# Altium project DB25-relay-HV-control.PrjPcb
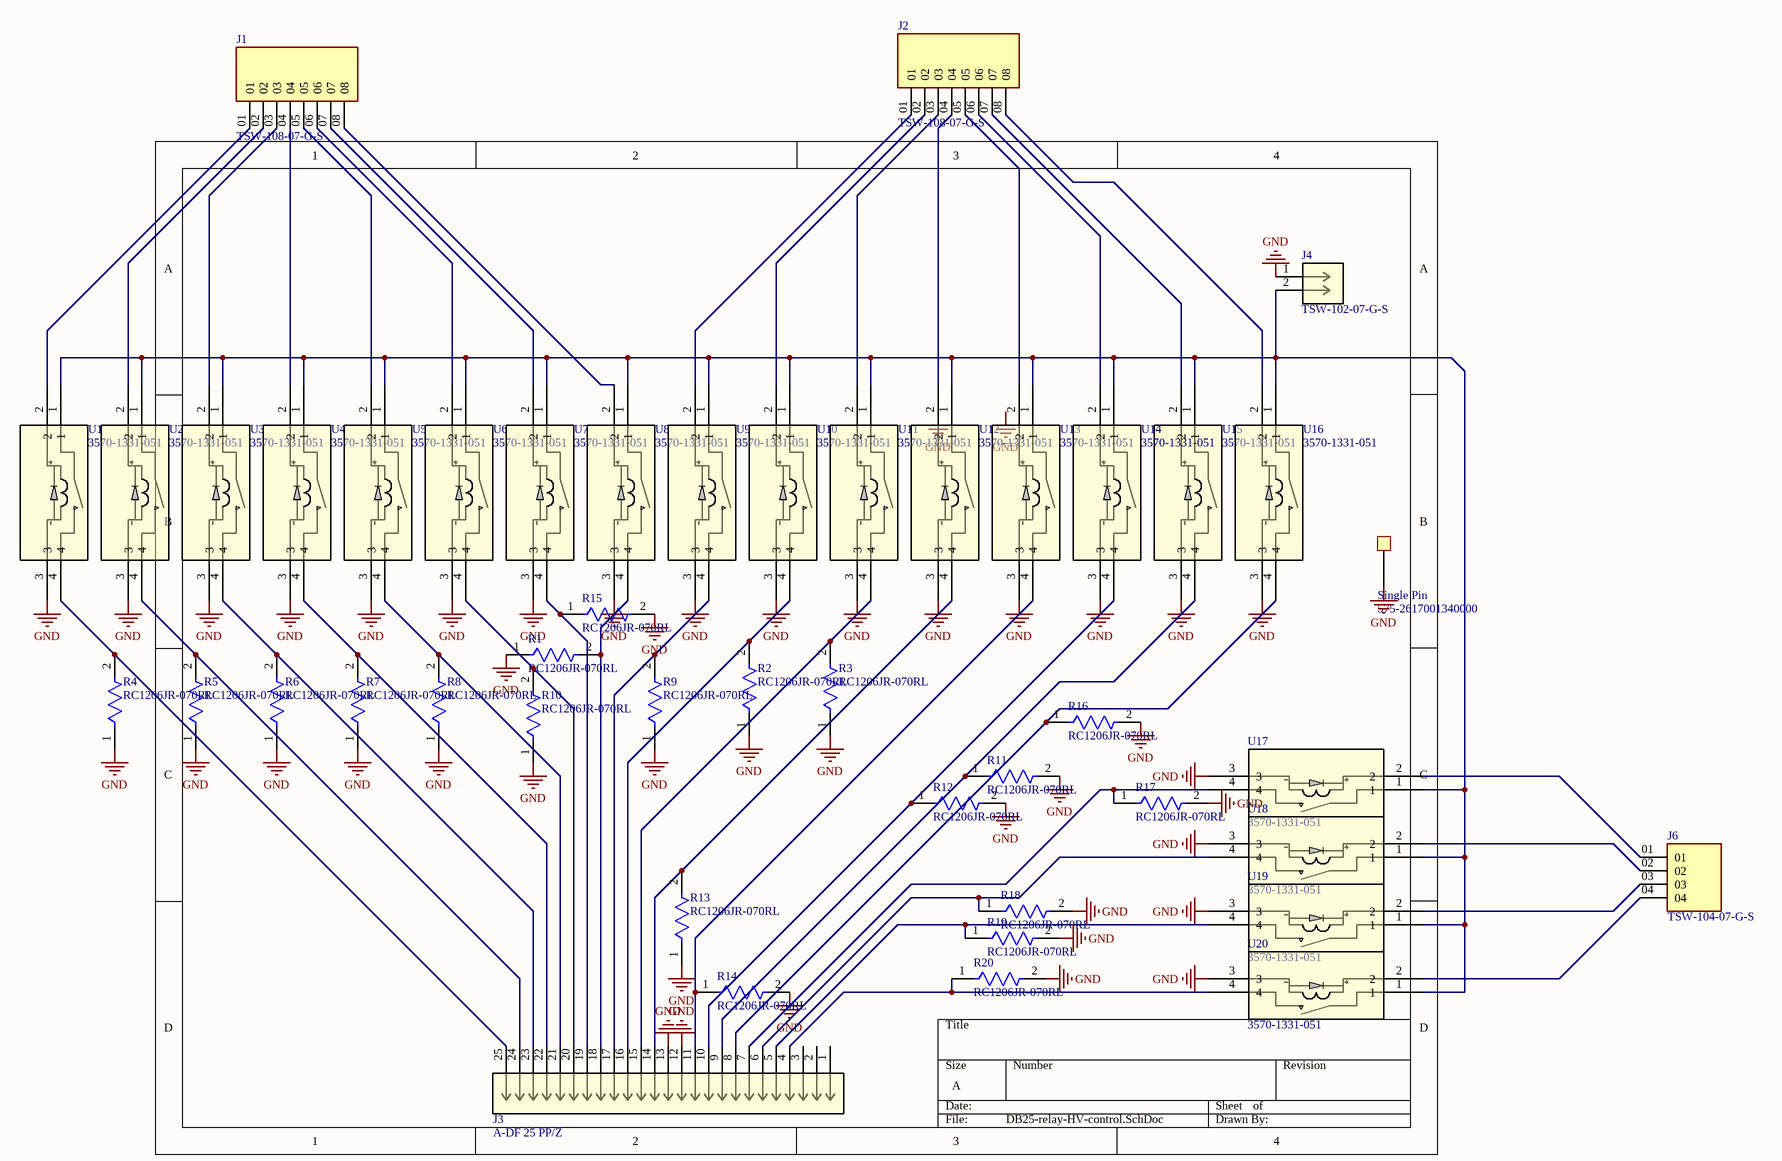
[diagram p0: DB25-relay-HV-control.SchDoc]
1 sheet, 46 parts. Net scope: global (net labels, ports and power ports of the same name join across sheets).
Board file: DB25-relay-HV-control.PcbDoc

## Sheet DB25-relay-HV-control.SchDoc
size A; SheetNumber: 1; SheetTotal: 1

### Parts
J1  TSW-108-07-G-S  [SAMTEC_TSW-108-07-G-S]
J2  TSW-108-07-G-S  [SAMTEC_TSW-108-07-G-S]
J3  A-DF 25 PP/Z  [CONN_A-DF 25 PPZ_ASM]
J4  TSW-102-07-G-S  [CON2_1X2_TU_TSW]
J5  Single Pin  Supplier Part Number 1: 575-2617001340000  [Single PC Pin]
J6  TSW-104-07-G-S  [SAMTEC_TSW-104-07-G-S]
R1  RC1206JR-070RL  [FP-RC1206-MFG]
R2  RC1206JR-070RL  [FP-RC1206-MFG]
R3  RC1206JR-070RL  [FP-RC1206-MFG]
R4  RC1206JR-070RL  [FP-RC1206-MFG]
R5  RC1206JR-070RL  [FP-RC1206-MFG]
R6  RC1206JR-070RL  [FP-RC1206-MFG]
R7  RC1206JR-070RL  [FP-RC1206-MFG]
R8  RC1206JR-070RL  [FP-RC1206-MFG]
R9  RC1206JR-070RL  [FP-RC1206-MFG]
R10  RC1206JR-070RL  [FP-RC1206-MFG]
R11  RC1206JR-070RL  [FP-RC1206-MFG]
R12  RC1206JR-070RL  [FP-RC1206-MFG]
R13  RC1206JR-070RL  [FP-RC1206-MFG]
R14  RC1206JR-070RL  [FP-RC1206-MFG]
R15  RC1206JR-070RL  [FP-RC1206-MFG]
R16  RC1206JR-070RL  [FP-RC1206-MFG]
R17  RC1206JR-070RL  [FP-RC1206-MFG]
R18  RC1206JR-070RL  [FP-RC1206-MFG]
R19  RC1206JR-070RL  [FP-RC1206-MFG]
R20  RC1206JR-070RL  [FP-RC1206-MFG]
U1  3570-1331-051  [SIP_3570-1331_COM]
U2  3570-1331-051  [SIP_3570-1331_COM]
U3  3570-1331-051  [SIP_3570-1331_COM]
U4  3570-1331-051  [SIP_3570-1331_COM]
U5  3570-1331-051  [SIP_3570-1331_COM]
U6  3570-1331-051  [SIP_3570-1331_COM]
U7  3570-1331-051  [SIP_3570-1331_COM]
U8  3570-1331-051  [SIP_3570-1331_COM]
U9  3570-1331-051  [SIP_3570-1331_COM]
U10  3570-1331-051  [SIP_3570-1331_COM]
U11  3570-1331-051  [SIP_3570-1331_COM]
U12  3570-1331-051  [SIP_3570-1331_COM]
U13  3570-1331-051  [SIP_3570-1331_COM]
U14  3570-1331-051  [SIP_3570-1331_COM]
U15  3570-1331-051  [SIP_3570-1331_COM]
U16  3570-1331-051  [SIP_3570-1331_COM]
U17  3570-1331-051  [SIP_3570-1331_COM]
U18  3570-1331-051  [SIP_3570-1331_COM]
U19  3570-1331-051  [SIP_3570-1331_COM]
U20  3570-1331-051  [SIP_3570-1331_COM]

### Nets
GND: J3.12 J3.13 J4.1 J5.1 R1.1 R2.1 R3.1 R4.1 R5.1 R6.1 R7.1 R8.1 R9.1 R10.1 R11.2 R12.2 R13.1 R14.2 R15.2 R16.2 R17.2 R18.2 R19.2 R20.2 U1.3 U2.3 U3.3 U4.3 U5.3 U6.3 U7.3 U8.3 U9.3 U10.3 U11.3 U12.3 U13.3 U14.3 U15.3 U16.3 U17.3 U18.3 U19.3 U20.3
NetJ1_01: J1.01 U1.2
NetJ1_02: J1.02 U2.2
NetJ1_03: J1.03 U3.2
NetJ1_04: J1.04 U4.2
NetJ1_05: J1.05 U5.2
NetJ1_06: J1.06 U6.2
NetJ1_07: J1.07 U7.2
NetJ1_08: J1.08 U8.2
NetJ2_01: J2.01 U9.2
NetJ2_02: J2.02 U10.2
NetJ2_03: J2.03 U11.2
NetJ2_04: J2.04 U12.2
NetJ2_05: J2.05 U13.2
NetJ2_06: J2.06 U14.2
NetJ2_07: J2.07 U15.2
NetJ2_08: J2.08 U16.2
NetJ3_4: J3.4 R20.1 U20.4
NetJ3_5: J3.5 R19.1 U19.4
NetJ3_6: J3.6 R18.1 U18.4
NetJ3_7: J3.7 R17.1 U17.4
NetJ3_8: J3.8 R16.1 U16.4
NetJ3_9: J3.9 R11.1 U15.4
NetJ3_10: J3.10 R12.1 U14.4
NetJ3_11: J3.11 R14.1 U13.4
NetJ3_14: J3.14 R13.2 U12.4
NetJ3_15: J3.15 R3.2 U11.4
NetJ3_16: J3.16 R2.2 U10.4
NetJ3_17: J3.17 R9.2 U9.4
NetJ3_18: J3.18 R1.2 U8.4
NetJ3_19: J3.19 R15.1 U7.4
NetJ3_20: J3.20 R10.2 U6.4
NetJ3_21: J3.21 R8.2 U5.4
NetJ3_22: J3.22 R7.2 U4.4
NetJ3_23: J3.23 R6.2 U3.4
NetJ3_24: J3.24 R5.2 U2.4
NetJ3_25: J3.25 R4.2 U1.4
NetJ4_2: J4.2 U1.1 U2.1 U3.1 U4.1 U5.1 U6.1 U7.1 U8.1 U9.1 U10.1 U11.1 U12.1 U13.1 U14.1 U15.1 U16.1 U17.1 U18.1 U19.1 U20.1
NetJ6_01: J6.01 U17.2
NetJ6_02: J6.02 U18.2
NetJ6_03: J6.03 U19.2
NetJ6_04: J6.04 U20.2

Not connected (* = marked no-connect by the designer): J3 1 2 3

### Notes on the sheet
- Labels drawn without touching a wire or pin: GND

### Library data of the parts
J1 J2 = TSW-108-07-G-S: TSW - Samtec 2.54mm Pin Header 10.92mm Overall Pin Length (07) - Fast Stock; MF: Samtec Inc.; SnapEDA_Link: https://www.snapeda.com/parts/TSW-108-07-G-S/Samtec+Inc./view-part/?ref=snap; Package: None; Value: *; MP: TSW-108-07-G-S; Check_prices: https://www.snapeda.com/parts/TSW-108-07-G-S/Samtec+Inc./view-part/?ref=eda
J3 = A-DF 25 PPZ: No Description Available; Mfr_Name: Assmann; Copyright: Copyright (C) 2024 Ultra Librarian. All rights reserved.; Manufacturer_Part_Number: A-DF 25 PP/Z; RefDes: RefDes; Type: DEV
J4 = TSW-102-07-G-S: No Description Available; Mfr_Name: Samtec Inc; Copyright: Copyright (C) 2024 Ultra Librarian. All rights reserved.; Manufacturer_Part_Number: TSW-102-07-G-S; RefDes: RefDes; Type: DEV
J5 = Single PC Pin: Supplier 1: Mouser
J6 = TSW-104-07-G-S: <a href="https://pricing.snapeda.com/parts/TSW-104-07-G-S/Samtec/view-part?ref=eda">Check availability</a>; MP: altium_native_batch; Package: None; Price: None; Value: *; Availability: Unavailable
R1-R20 = CMP-2100-03681-2: RES SMD 0 OHM JUMPER 1/4W 1206; Manufacturer: YAGEO; Voltage Rating: 200V; Temperature Coefficient: 300ppm/°C; Power Rating: 0.25W; Value: 0Ω; Tolerance: 5%; Manufacturer Part Number: RC1206JR-070RL; Temperature Range Low: -55°C; Category: Res; Automotive: No; Ipc Land Pattern Name: RESC310160X55; Device Class L1: Passive Components; Temperature: -55°C to +155°C; ComponentLink2URL: https://www.yageo.com/upload/media/product/productsearch/datasheet/rchip/PYu-RC_Group_51_RoHS_L_10.pdf; Lead Free: Yes; Height: 0.65mm; Footprint Url: https://www.yageo.com/upload/website/yageo_PYu-R_Mount_10_19050818_343.pdf; Package: RC1206; Digikey Description: RES SMD 0 OHM JUMPER 1/4W 1206; Temperature Range High: +155°C; Device Class L3: Chip SMD Resistors; Device Class L2: Resistors; Octopart: https://octopart.com/rc1206jr-070rl-yageo-40025601; Resistance: 0Ω; Series: RC; ComponentLink2Description: Datasheet; Composition: Thick Film; RoHS: TRUE; Mouser Description: Resistor: thick film; SMD; 1206; 0O; 0.25W; ±5%; -55÷155°C
U1-U20 = 3570-1331-051: No Description Available; Mfr_Name: Comus; Copyright: Copyright (C) 2024 Ultra Librarian. All rights reserved.; Manufacturer_Part_Number: 3570-1331-051; RefDes: RefDes; Type: DEV